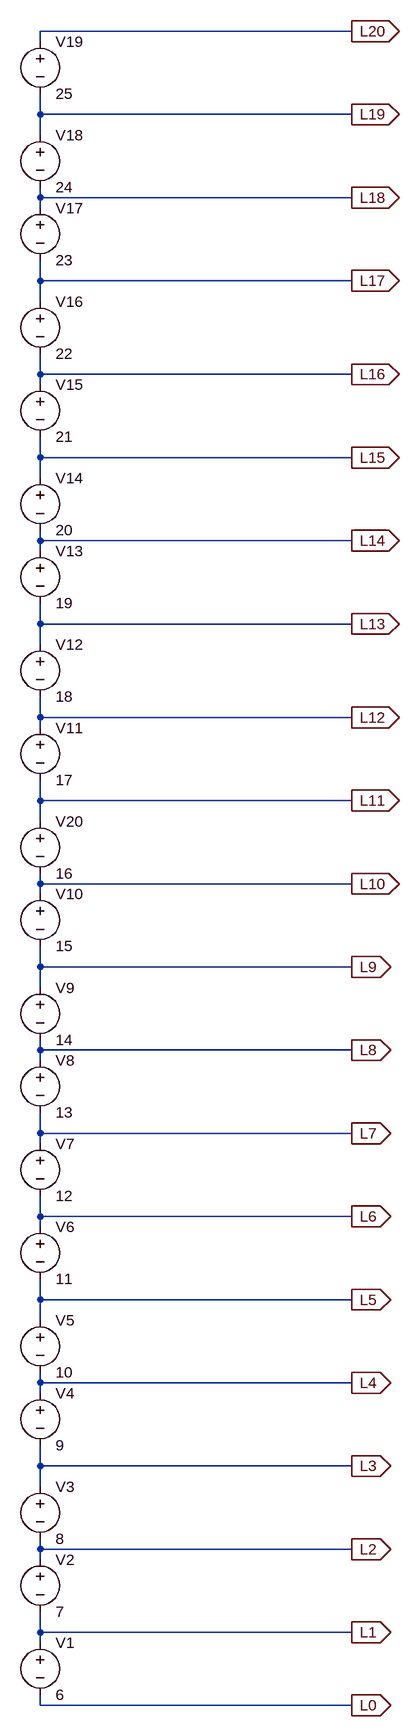
[diagram p0: schematic BatStack.asc]
BatStack.asc, the LTspice schematic file:
Version 4
SHEET 1 880 1592
WIRE 640 -1104 160 -1104
WIRE 160 -1088 160 -1104
WIRE 160 -976 160 -1008
WIRE 640 -976 160 -976
WIRE 160 -944 160 -976
WIRE 160 -848 160 -864
WIRE 640 -848 160 -848
WIRE 160 -832 160 -848
WIRE 160 -720 160 -752
WIRE 640 -720 160 -720
WIRE 160 -688 160 -720
WIRE 160 -576 160 -608
WIRE 640 -576 160 -576
WIRE 160 -560 160 -576
WIRE 160 -448 160 -480
WIRE 640 -448 160 -448
WIRE 160 -416 160 -448
WIRE 160 -320 160 -336
WIRE 640 -320 160 -320
WIRE 160 -304 160 -320
WIRE 160 -192 160 -224
WIRE 640 -192 160 -192
WIRE 160 -160 160 -192
WIRE 160 -48 160 -80
WIRE 640 -48 160 -48
WIRE 160 -32 160 -48
WIRE 160 80 160 48
WIRE 640 80 160 80
WIRE 160 112 160 80
WIRE 160 208 160 192
WIRE 640 208 160 208
WIRE 160 224 160 208
WIRE 160 336 160 304
WIRE 640 336 160 336
WIRE 160 368 160 336
WIRE 160 464 160 448
WIRE 640 464 160 464
WIRE 160 480 160 464
WIRE 160 592 160 560
WIRE 640 592 160 592
WIRE 160 608 160 592
WIRE 160 720 160 688
WIRE 640 720 160 720
WIRE 160 736 160 720
WIRE 160 848 160 816
WIRE 640 848 160 848
WIRE 160 880 160 848
WIRE 160 976 160 960
WIRE 640 976 160 976
WIRE 160 992 160 976
WIRE 160 1104 160 1072
WIRE 640 1104 160 1104
WIRE 160 1136 160 1104
WIRE 160 1232 160 1216
WIRE 640 1232 160 1232
WIRE 160 1248 160 1232
WIRE 160 1360 160 1328
WIRE 640 1360 160 1360
WIRE 160 1376 160 1360
WIRE 160 1472 160 1456
WIRE 640 1472 160 1472
FLAG 640 1472 L0
IOPIN 640 1472 Out
FLAG 640 1360 L1
IOPIN 640 1360 Out
FLAG 640 1232 L2
IOPIN 640 1232 Out
FLAG 640 1104 L3
IOPIN 640 1104 Out
FLAG 640 976 L4
IOPIN 640 976 Out
FLAG 640 848 L5
IOPIN 640 848 Out
FLAG 640 720 L6
IOPIN 640 720 Out
FLAG 640 592 L7
IOPIN 640 592 Out
FLAG 640 464 L8
IOPIN 640 464 Out
FLAG 640 336 L9
IOPIN 640 336 Out
FLAG 640 208 L10
IOPIN 640 208 Out
FLAG 640 80 L11
IOPIN 640 80 Out
FLAG 640 -48 L12
IOPIN 640 -48 Out
FLAG 640 -192 L13
IOPIN 640 -192 Out
FLAG 640 -320 L14
IOPIN 640 -320 Out
FLAG 640 -448 L15
IOPIN 640 -448 Out
FLAG 640 -576 L16
IOPIN 640 -576 Out
FLAG 640 -720 L17
IOPIN 640 -720 Out
FLAG 640 -848 L18
IOPIN 640 -848 Out
FLAG 640 -976 L19
IOPIN 640 -976 Out
FLAG 640 -1104 L20
IOPIN 640 -1104 Out
SYMBOL voltage 160 1360 R0
WINDOW 123 0 0 Left 0
WINDOW 39 0 0 Left 0
SYMATTR InstName V1
SYMATTR Value 6
SYMBOL voltage 160 1232 R0
WINDOW 123 0 0 Left 0
WINDOW 39 0 0 Left 0
SYMATTR InstName V2
SYMATTR Value 7
SYMBOL voltage 160 1120 R0
WINDOW 123 0 0 Left 0
WINDOW 39 0 0 Left 0
SYMATTR InstName V3
SYMATTR Value 8
SYMBOL voltage 160 976 R0
WINDOW 123 0 0 Left 0
WINDOW 39 0 0 Left 0
SYMATTR InstName V4
SYMATTR Value 9
SYMBOL voltage 160 864 R0
WINDOW 123 0 0 Left 0
WINDOW 39 0 0 Left 0
SYMATTR InstName V5
SYMATTR Value 10
SYMBOL voltage 160 720 R0
WINDOW 123 0 0 Left 0
WINDOW 39 0 0 Left 0
SYMATTR InstName V6
SYMATTR Value 11
SYMBOL voltage 160 592 R0
WINDOW 123 0 0 Left 0
WINDOW 39 0 0 Left 0
SYMATTR InstName V7
SYMATTR Value 12
SYMBOL voltage 160 464 R0
WINDOW 123 0 0 Left 0
WINDOW 39 0 0 Left 0
SYMATTR InstName V8
SYMATTR Value 13
SYMBOL voltage 160 352 R0
WINDOW 123 0 0 Left 0
WINDOW 39 0 0 Left 0
SYMATTR InstName V9
SYMATTR Value 14
SYMBOL voltage 160 208 R0
WINDOW 123 0 0 Left 0
WINDOW 39 0 0 Left 0
SYMATTR InstName V10
SYMATTR Value 15
SYMBOL voltage 160 -48 R0
WINDOW 123 0 0 Left 0
WINDOW 39 0 0 Left 0
SYMATTR InstName V11
SYMATTR Value 17
SYMBOL voltage 160 -176 R0
WINDOW 123 0 0 Left 0
WINDOW 39 0 0 Left 0
SYMATTR InstName V12
SYMATTR Value 18
SYMBOL voltage 160 -320 R0
WINDOW 123 0 0 Left 0
WINDOW 39 0 0 Left 0
SYMATTR InstName V13
SYMATTR Value 19
SYMBOL voltage 160 -432 R0
WINDOW 123 0 0 Left 0
WINDOW 39 0 0 Left 0
SYMATTR InstName V14
SYMATTR Value 20
SYMBOL voltage 160 -576 R0
WINDOW 123 0 0 Left 0
WINDOW 39 0 0 Left 0
SYMATTR InstName V15
SYMATTR Value 21
SYMBOL voltage 160 -704 R0
WINDOW 123 0 0 Left 0
WINDOW 39 0 0 Left 0
SYMATTR InstName V16
SYMATTR Value 22
SYMBOL voltage 160 -848 R0
WINDOW 123 0 0 Left 0
WINDOW 39 0 0 Left 0
SYMATTR InstName V17
SYMATTR Value 23
SYMBOL voltage 160 -960 R0
WINDOW 123 0 0 Left 0
WINDOW 39 0 0 Left 0
SYMATTR InstName V18
SYMATTR Value 24
SYMBOL voltage 160 -1104 R0
WINDOW 123 0 0 Left 0
WINDOW 39 0 0 Left 0
SYMATTR InstName V19
SYMATTR Value 25
SYMBOL voltage 160 96 R0
WINDOW 123 0 0 Left 0
WINDOW 39 0 0 Left 0
SYMATTR InstName V20
SYMATTR Value 16

The netlist it stands for:
* BatStack.asc
V1 L1 L0 6
V2 L2 L1 7
V3 L3 L2 8
V4 L4 L3 9
V5 L5 L4 10
V6 L6 L5 11
V7 L7 L6 12
V8 L8 L7 13
V9 L9 L8 14
V10 L10 L9 15
V11 L12 L11 17
V12 L13 L12 18
V13 L14 L13 19
V14 L15 L14 20
V15 L16 L15 21
V16 L17 L16 22
V17 L18 L17 23
V18 L19 L18 24
V19 L20 L19 25
V20 L11 L10 16
.backanno
.end